# Altium schematic sheet 04 Neo6M.SchDoc
size A3; SheetNumber: 5; SheetTotal: 5
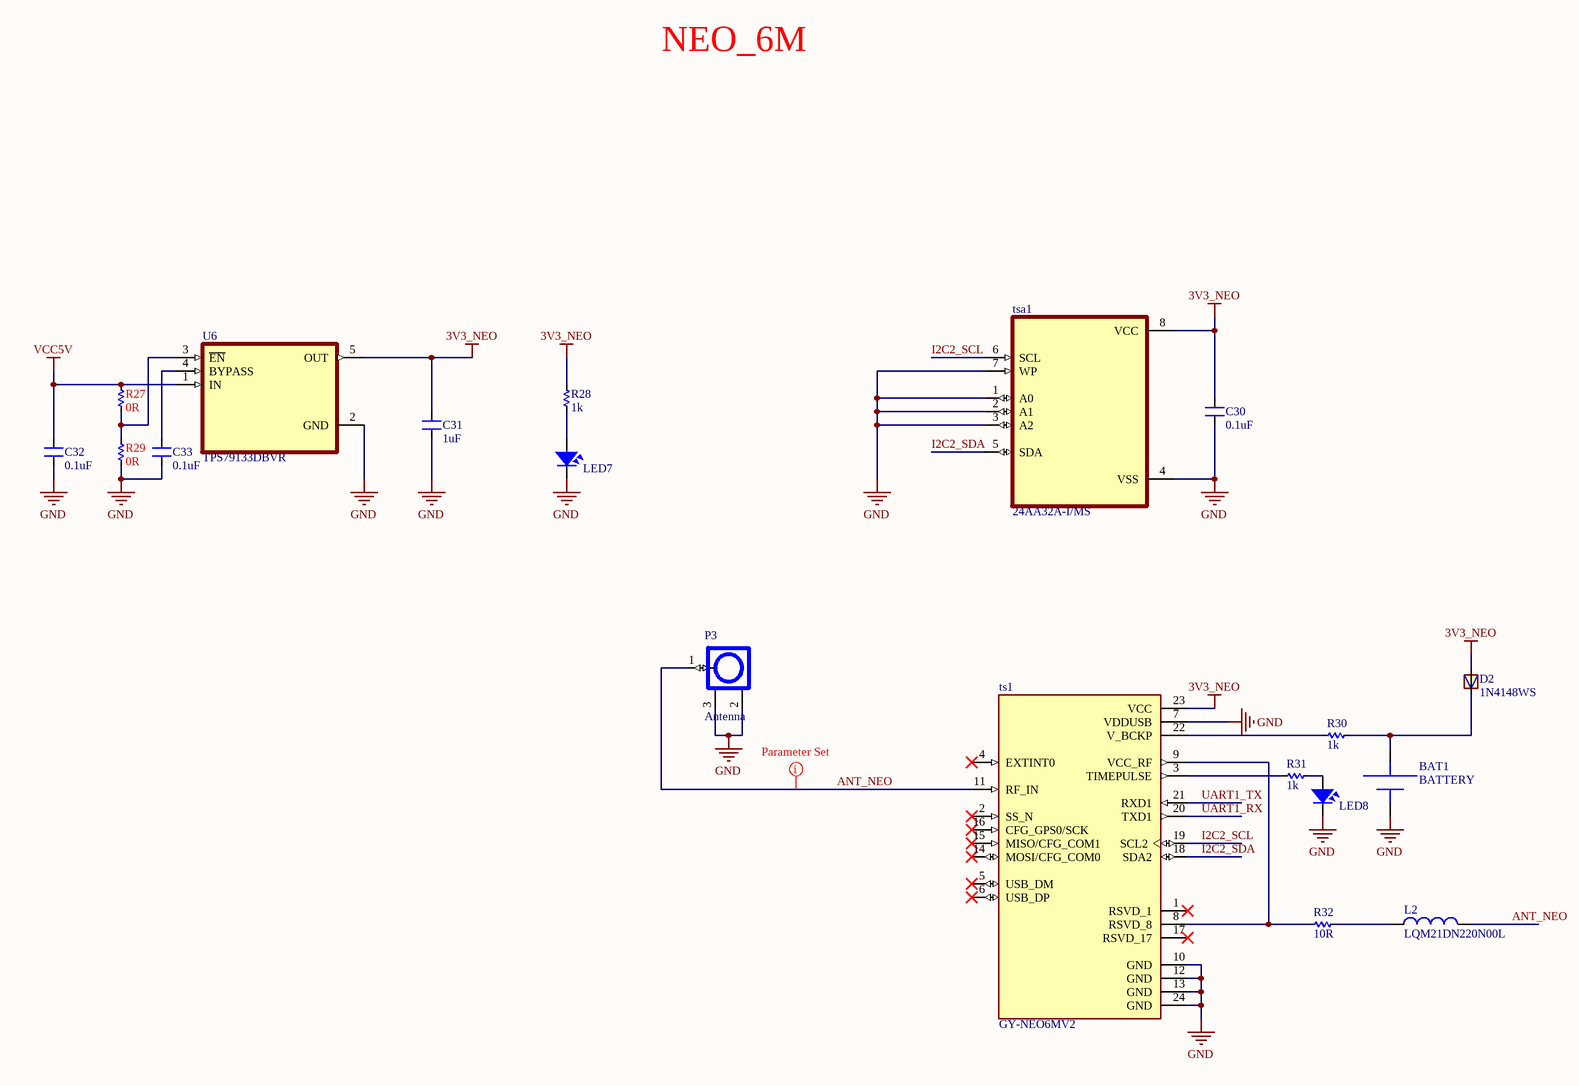
[diagram p0: 04 Neo6M.SchDoc]

## Parts
BAT1  BATTERY  [BATTERY_CON]
C30  0.1uF  [C 0603]
C31  1uF  [C 0603]
C32  0.1uF  [C 0603]
C33  0.1uF  [C 0603]
D2  1N4148WS  [SOD323]
L2  LQM21DN220N00L  [INDC2012X145N]
LED7  LED  [LED-0603]  (value not drawn)
LED8  LED  [LED-0603]  (value not drawn)
P3  Antenna  [IPXS]
R27  0R  [RES-SMD-0603]
R28  1k  [RES-SMD-0603]
R29  0R  [RES-SMD-0603]
R30  1k  [RES-SMD-0603]
R31  1k  [RES-SMD-0603]
R32  10R  [RES-SMD-0603]
ts1  GY-NEO6MV2  [XCVR_GY-NEO6MV2]
tsa1  24AA32A-I/MS  [SOP65P490X110-8N]
U6  TPS79133DBVR  [SOT95P280X145-5N]

## Nets
3V3_NEO: C30.2 C31.2 D2.A R28.1 ts1.23(VCC) tsa1.8(VCC) U6.5(OUT)
GND: BAT1.0 C30.1 C31.1 C32.1 C33.1 LED7.2 LED8.2 P3.2 P3.3 R29.2 ts1.7(VDDUSB) ts1.10(GND) ts1.12(GND) ts1.13(GND) ts1.24(GND) tsa1.1(A0) tsa1.2(A1) tsa1.3(A2) tsa1.4(VSS) tsa1.7(WP) U6.2(GND)
VCC5V: C32.2 R27.1 U6.1(IN)
ANT_NEO: L2.2 P3.1 ts1.11(RF_IN)
I2C2_SCL: ts1.19(SCL2) tsa1.6(SCL)
I2C2_SDA: ts1.18(SDA2) tsa1.5(SDA)
UART1_RX: ts1.20(TXD1)
UART1_TX: ts1.21(RXD1)
NetBAT1_1: BAT1.1 D2.C R30.1
NetC33_2: C33.2 U6.4(BYPASS)
NetL2_1: L2.1 R32.1
NetLED7_1: LED7.1 R28.2
NetLED8_1: LED8.1 R31.1
NetR27_2: R27.2 R29.1 U6.3(~{EN})
NetR30_2: R30.2 ts1.22(V_BCKP)
NetR31_2: R31.2 ts1.3(TIMEPULSE)
NetR32_2: R32.2 ts1.8(RSVD_8) ts1.9(VCC_RF)

Not connected (* = marked no-connect by the designer): ts1 1(RSVD_1)* 2(SS_N)* 4(EXTINT0)* 5(USB_DM)* 6(USB_DP)* 14(MOSI/CFG_COM0)* 15(MISO/CFG_COM1)* 16(CFG_GPS0/SCK)* 17(RSVD_17)*

## Notes on the sheet
- NEO_6M

## Library data of the parts
C30-C33 = CAP_SMD: 16V; Value: 33pF
D2 = 1N4148WS: Small Signal Diode, SOD-323F, 100V, 0.15A, 150Â°C; MF: Diotec Semiconductor; SnapEDA_Link: https://www.snapeda.com/parts/1N4148WS/Diotec/view-part/?ref=snap; Package: SOD-323F Diotec; Value: *; MP: 1N4148WS; Check_prices: https://www.snapeda.com/parts/1N4148WS/Diotec/view-part/?ref=eda
L2 = LQM21DN220N00L: Inductor with Inductance: 22uH Tol. +/-30%, Package: 0805 (2012); MF: Murata; Purchase-URL: https://pricing.snapeda.com/search/part/LQM21DN220N00L/?ref=eda; Price: None; SnapEDA_Link: https://www.snapeda.com/parts/LQM21DN220N00L/Murata%20Electronics%20North%20America/view-part/518317/?ref=snap; Package: 2012 Bourns; Availability: Warning; Value: *; MP: LQM21DN220N00L
LED7 LED8 = LED SMD: Value: LED 3 - 5 ly 2 Colour
P3 = IPXSx66: Antenna GSM GPS
R27-R32 = Res-SMD: RES_SMD; Manufacturer: Generic Components; Class: Passive; Published: 08/06/2000; Publisher: Altium Hobart Technology Centre
ts1 = GY-NEO6MV2: The NEO-6 module series is a family of stand-alone GPS receivers featuring the high performance u-blox 6positioning engine.; MF: Ublox; SnapEDA_Link: https://www.snapeda.com/parts/GY-NEO6MV2/Ublox/view-part/?ref=snap; Package: Package; Value: *; MP: GY-NEO6MV2; Check_prices: https://www.snapeda.com/parts/GY-NEO6MV2/Ublox/view-part/?ref=eda
tsa1 = 24AA32A-I/MS: EEPROM Memory IC 32Kb _4K x 8_ IÂ²C 400kHz 900ns 8-MSOP; MF: Microchip; Price: None; SnapEDA_Link: https://www.snapeda.com/parts/24AA32A-I/MS/Microchip/view-part/138275/?ref=snap; MP: 24AA32A-I/MS; Value: *; Availability: Unavailable; Package: MSOP-8 Microchip
U6 = TPS79133DBVR: 100-mA, low-noise, low-dropout voltage regulator with enable; MF: Texas Instruments; Price: None; Availability: In Stock; Package: SOT-23-5 Texas Instruments; MP: TPS79133DBVR; Value: *; SnapEDA_Link: https://www.snapeda.com/parts/TPS79133DBVR/Texas+Instruments/view-part/?ref=snap; Purchase-URL: https://pricing.snapeda.com/search/part/TPS79133DBVR/?ref=eda; Check_prices: https://www.snapeda.com/parts/TPS79133DBVR/Texas+Instruments/view-part/?ref=eda